# EAGLE schematic TrimTron6000_B (EAGLE 6.5.0)
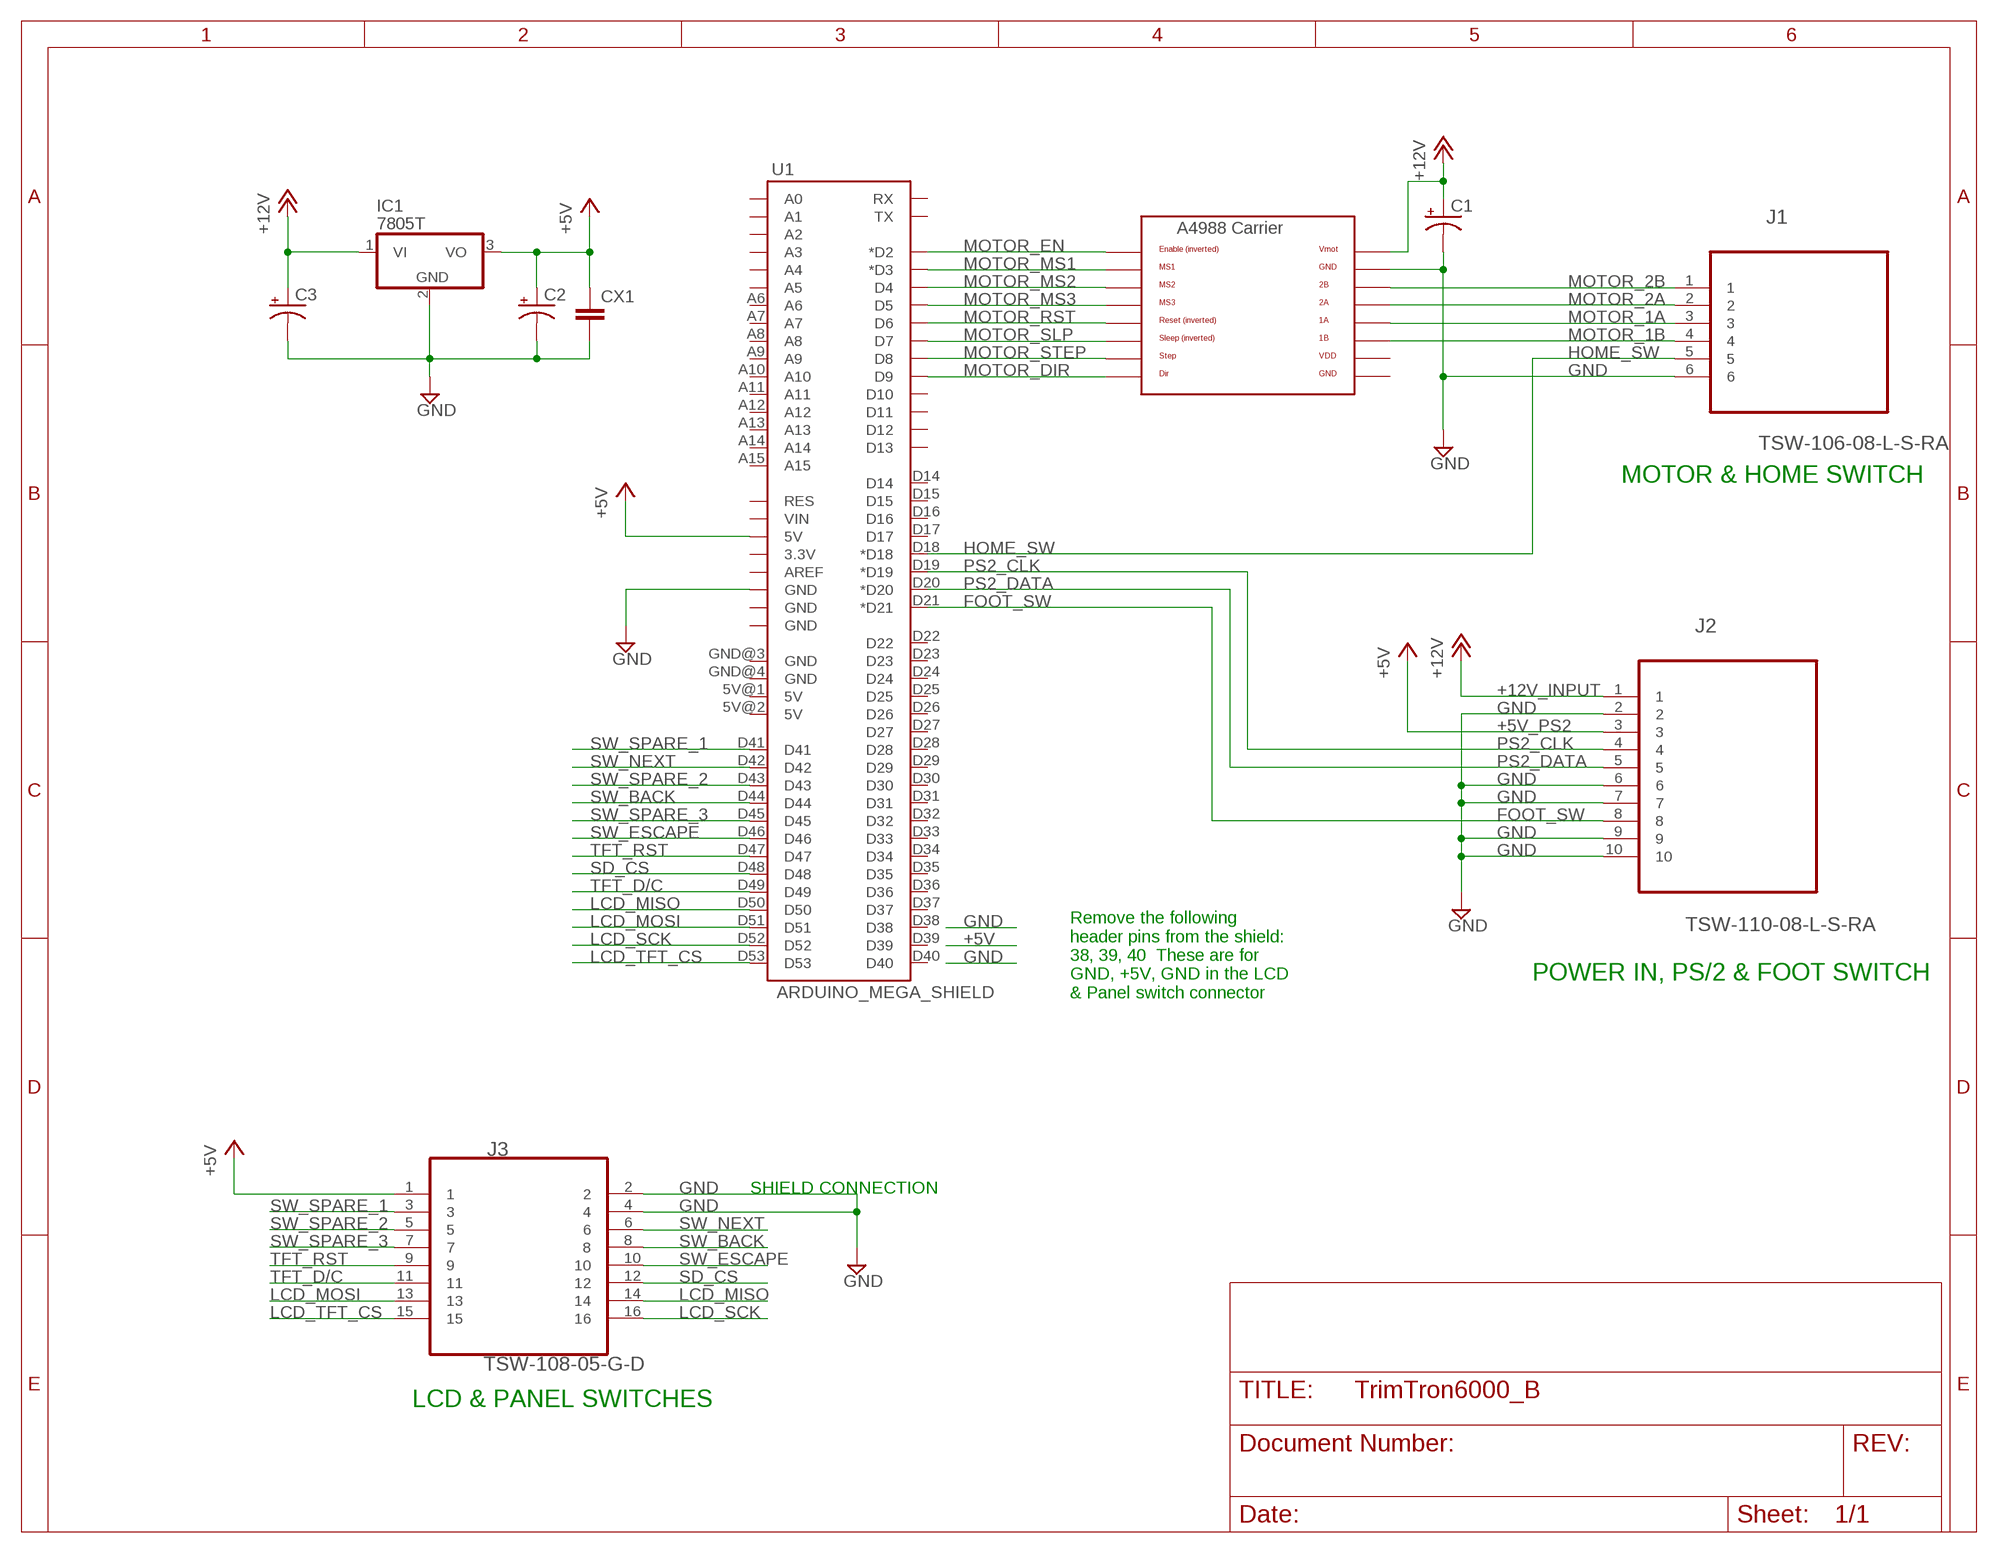
[diagram p0: schematic, sheet 1]

## Parts
C1  CPOL-USE5-13  [E5-13]
C2  CPOL-USE5-13  [E5-13]
C3  CPOL-USE5-13  [E5-13]
CX1  CXXC10B5  [XC10B5]
IC1  7805T  [TO220H]
J1  TSW-106-08-L-S-RA  [SAMTEC_TSW-106-08-L-S-RA]
J2  TSW-110-08-L-S-RA  [SAMTEC_TSW-110-08-L-S-RA]
J3  TSW-108-05-G-D  [SAMTEC_TSW-108-05-G-D]
U1  ARDUINO_MEGA_SHIELD  [ARDUINO_MEGA_SHIELD]
U$1  POLOLU_A4983CARRIER  [A4988BREAKOUT]

## Nets
+5V: J3.1
+5V_PS2: C2.+ CX1.1 IC1.3(VO) J2.3 ; supply symbol labelled +5V
+12V_INPUT: C3.+ IC1.1(VI) J2.1 ; supply symbol labelled +12V
FOOT_SW: J2.8 U1.D21(*D21)
GND: C1.- C2.- C3.- CX1.2 IC1.2(GND) J1.6 J2.2 J2.6 J2.7 J2.9 J2.10 J3.2 J3.4 U1.GND@2(GND) U$1.GND
HOME_SW: J1.5 U1.D18(*D18)
LCD_MISO: J3.14 U1.D50
LCD_MOSI: J3.13 U1.D51
LCD_SCK: J3.16 U1.D52
LCD_TFT_CS: J3.15 U1.D53
MOTOR_1A: J1.3 U$1.1A
MOTOR_1B: J1.4 U$1.1B
MOTOR_2A: J1.2 U$1.2A
MOTOR_2B: J1.1 U$1.2B
MOTOR_DIR: U1.D9 U$1.DIR
MOTOR_EN: U1.D2(*D2) U$1.EN
MOTOR_MS1: U1.D3(*D3) U$1.MS1
MOTOR_MS2: U1.D4 U$1.MS2
MOTOR_MS3: U1.D5 U$1.MS3
MOTOR_RST: U1.D6 U$1.RST
MOTOR_SLP: U1.D7 U$1.SLP(SLEEP)
MOTOR_STEP: U1.D8 U$1.STEP
POWER_IN: C1.+ U$1.VMOT ; supply symbol labelled +12V
PS2_5V: U1.5V@0(5V) ; supply symbol labelled +5V
PS2_CLK: J2.4 U1.D19(*D19)
PS2_DATA: J2.5 U1.D20(*D20)
SD_CS: J3.12 U1.D48
SW_BACK: J3.8 U1.D44
SW_ESCAPE: J3.10 U1.D46
SW_NEXT: J3.6 U1.D42
SW_SPARE_1: J3.3 U1.D41
SW_SPARE_2: J3.5 U1.D43
SW_SPARE_3: J3.7 U1.D45
TFT_D/C: J3.11 U1.D49
TFT_RST: J3.9 U1.D47
Unconnected: U1.3.3V U1.5V@1(5V) U1.5V@2(5V) U1.A0 U1.A1 U1.A2 U1.A3 U1.A4 U1.A5 U1.A6 U1.A7 U1.A8 U1.A9 U1.A10 U1.A11 U1.A12 U1.A13 U1.A14 U1.A15 U1.AREF U1.D10 U1.D11 U1.D12 U1.D13 U1.D14 U1.D15 U1.D16 U1.D17 U1.D22 U1.D23 U1.D24 U1.D25 U1.D26 U1.D27 U1.D28 U1.D29 U1.D30 U1.D31 U1.D32 U1.D33 U1.D34 U1.D35 U1.D36 U1.D37 U1.D38 U1.D39 U1.D40 U1.GND@0(GND) U1.GND@1(GND) U1.GND@3(GND) U1.GND@4(GND) U1.RES U1.RX U1.TX U1.VIN

## Notes on the sheet
- MOTOR & HOME SWITCH
- POWER IN, PS/2 & FOOT SWITCH
- Remove the following
  header pins from the shield:
  38, 39, 40  These are for
  GND, +5V, GND in the LCD
  & Panel switch connector
- SHIELD CONNECTION
- LCD & PANEL SWITCHES

## Power pins joined to a net without a drawn wire
GND: U$1.GND@0(GND)
VDD: U$1.VDD

## Library data of the parts
C1-C3 = rcl:CPOL-US: POLARIZED CAPACITOR, American symbol
CX1 = rcl:CX: X CAPACITOR for power line
IC1 = linear:78*: Positive VOLTAGE REGULATOR Source: http://cache.national.com/ds/LM/LM78L05.pdf http://www.fairchildsemi.com/ds/LM/LM7805.pdf
J1 = SAMTEC_TSW-XXX-S-X_By_element14_Batch_1:TSW-106-08-L-S-RA: CONN HEADER, 2.54MM, THT, R/A, 6WAY; MPN: TSW-106-08-L-S-RA; OC_FARNELL: 2041526; OC_NEWARK: 12P1534; PACKAGE: HEADER, 2.54MM, THT, R/A, 6WAY; SUPPLIER: Samtec
J2 = SAMTEC_TSW-XXX-S-X_By_element14_Batch_1:TSW-110-08-L-S-RA: CONN HEADER, 2.54MM, THT, R/A, 10WAY; MPN: TSW-110-08-L-S-RA; OC_FARNELL: 2041530; OC_NEWARK: 12P1805; PACKAGE: HEADER, 2.54MM, THT, R/A, 10WAY; SUPPLIER: Samtec
J3 = SAMTEC-TSW-xxx-D_By_element14_Batch_1:TSW-108-05-G-D: Through Hole Post Header; MPN: TSW-108-05-G-D; OC_FARNELL: 2024644; OC_NEWARK: 12P1639; PACKAGE: Post header-16Pin; SUPPLIER: Samtec
U1 = RepRapjr:ARDUINO_MEGA_SHIELD
U$1 = RepRapjr:POLOLU_A4983CARRIER